# EAGLE design QwiicHUD (EAGLE 9.1.0)
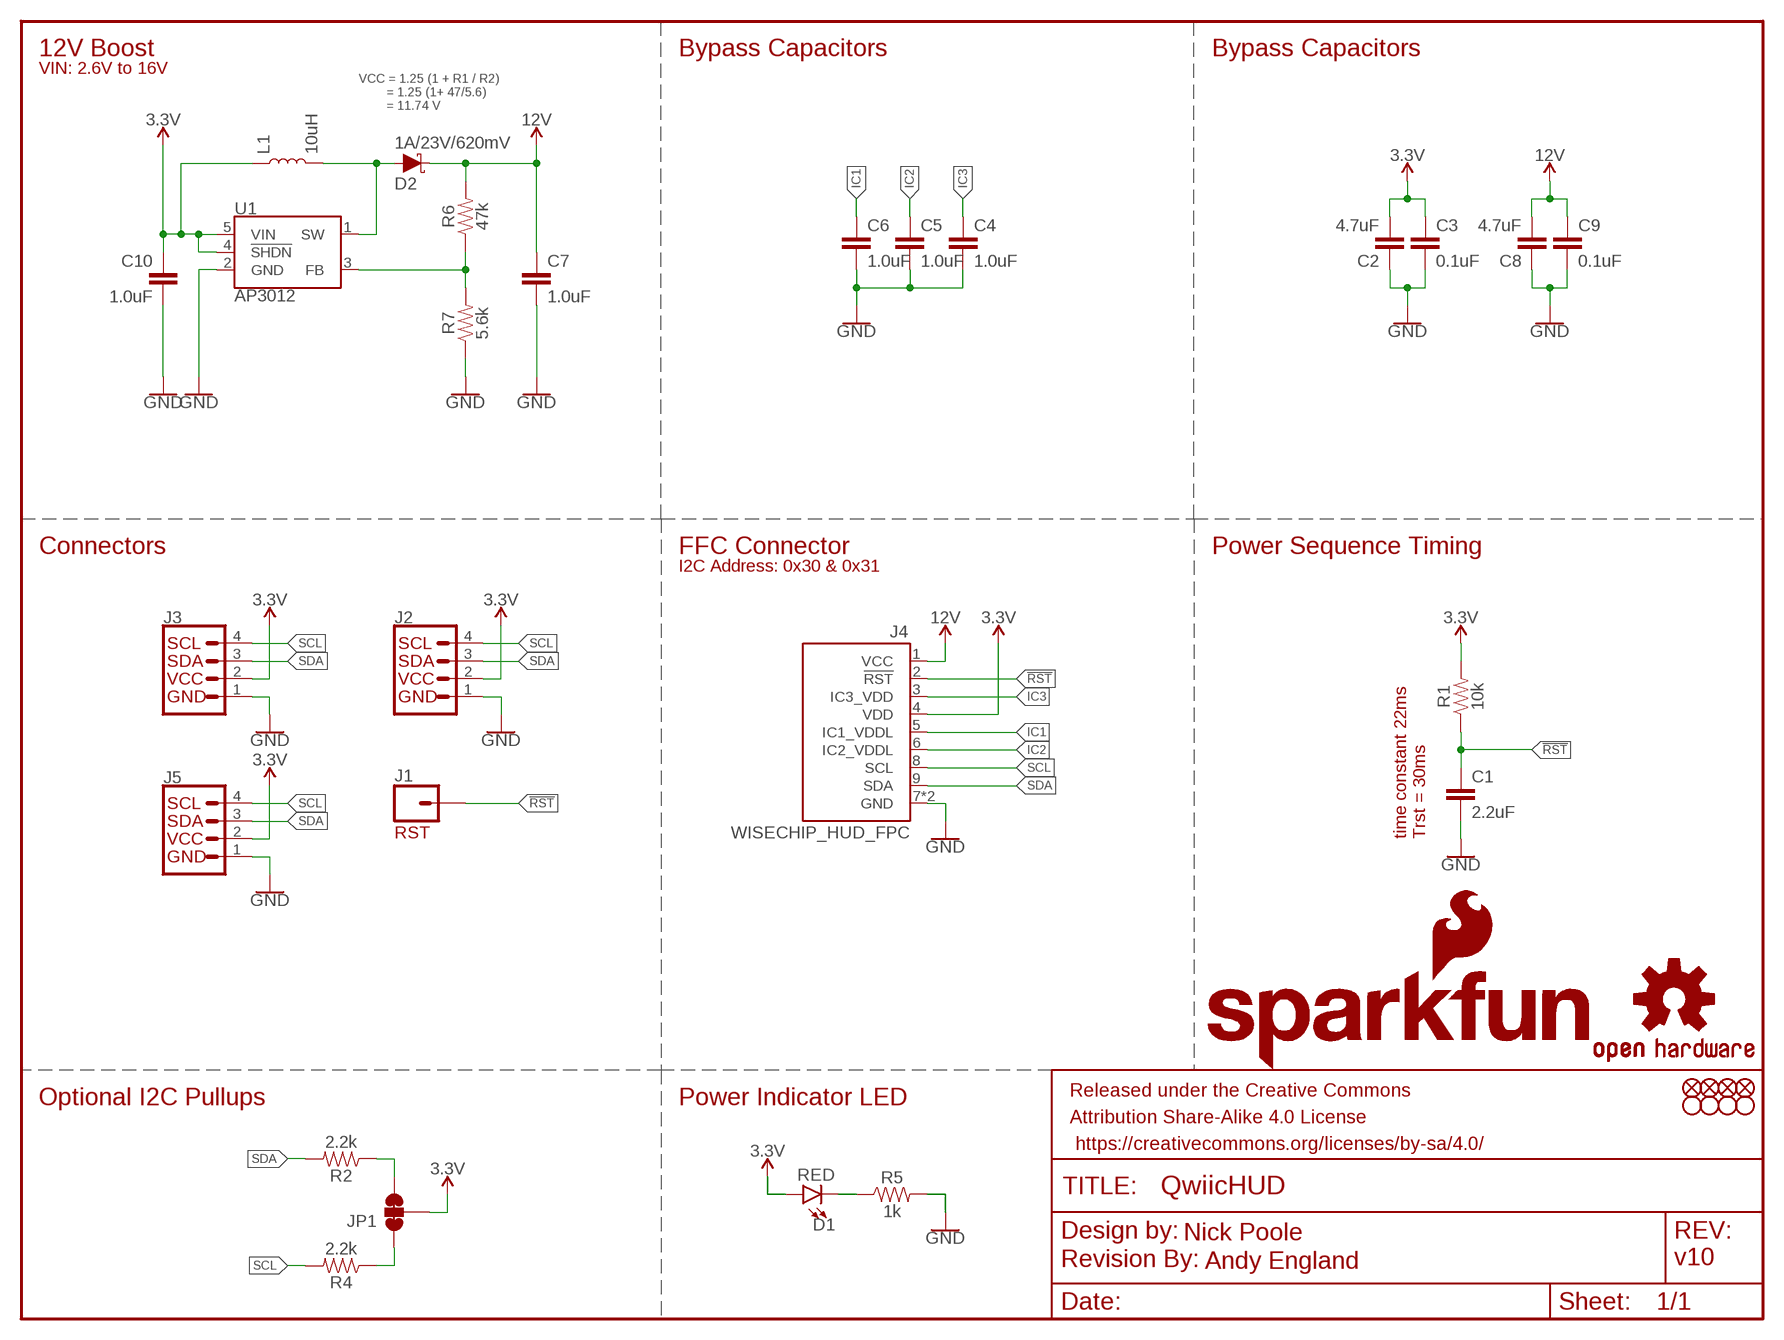
[diagram p0: schematic, sheet 1]

## Parts
C1  2.2uF  2.2UF-0603-10V-20%  [0603]
C2  4.7uF  4.7UF-0603-6.3V-(10%)  [0603]
C3  0.1uF  0.1UF-0603-25V-5%  [0603]
C4  1.0uF  1.0UF-0603-16V-10%  [0603]
C5  1.0uF  1.0UF-0603-16V-10%  [0603]
C6  1.0uF  1.0UF-0603-16V-10%  [0603]
C7  1.0uF  1.0UF-0805-25V-10%  [0805]
C8  4.7uF  4.7UF-0603-6.3V-(10%)  [0603]
C9  0.1uF  0.1UF-0603-25V-5%  [0603]
C10  1.0uF  1.0UF-0603-16V-10%  [0603]
D1  RED  LED-RED0603  [LED-0603]
D2  1A/23V/620mV  DIODE-SCHOTTKY-BAT20J  [SOD-323]
FD1  FIDUCIALUFIDUCIAL  [FIDUCIAL-MICRO]
FD2  FIDUCIALUFIDUCIAL  [FIDUCIAL-MICRO]
FD3  FIDUCIALUFIDUCIAL  [FIDUCIAL-MICRO]
FD4  FIDUCIALUFIDUCIAL  [FIDUCIAL-MICRO]
FRAME1  FRAME-LETTER  [CREATIVE_COMMONS]
H1  STAND-OFF  [STAND-OFF]
H2  STAND-OFF  [STAND-OFF]
H3  STAND-OFF  [STAND-OFF]
H4  STAND-OFF  [STAND-OFF]
J1  CONN_01PTH_NO_SILK_YES_STOP  [1X01_NO_SILK]
J2  I2C_STANDARD_NO_SILK  [1X04_NO_SILK]
J3  QWIIC_CONNECTORJS-1MM  [1X04_1MM_RA]
J4  WISECHIP_HUD_FPC  [SERIES6288]
J5  QWIIC_CONNECTORJS-1MM  [1X04_1MM_RA]
JP1  JUMPER-SMT_3_2-NC_TRACE_SILK  [SMT-JUMPER_3_2-NC_TRACE_SILK]
L1  10uH  INDUCTOR-CDRH-10UH  [INDUCTOR_4.7UH]
LOGO1  OSHW-LOGOS  [OSHW-LOGO-S]
LOGO2  SFE_LOGO_NAME_FLAME.1_INCH  [SFE_LOGO_NAME_FLAME_.1]
LOGO3  SFE_LOGO_FLAME.1_INCH  [SFE_LOGO_FLAME_.1]
LOGO4  REVISION  [REVISION]
R1  10k  10KOHM-0603-1/10W-1%  [0603]
R2  2.2k  2.2KOHM-0603-1/10W-1%  [0603]
R4  2.2k  2.2KOHM-0603-1/10W-1%  [0603]
R5  1k  1KOHM-0603-1/10W-1%  [0603]
R6  47k  47KOHM-0603-1/10W-1%  [0603]
R7  5.6k  5.6KOHM-0603-1/10W-1%  [0603]
U1  AP3012  [SOT23-5]

## Nets
3.3V: C2.2 C3.1 C10.1 D1.A J2.2(VCC) J3.2 J4.4(VDD) J5.2 JP1.2 L1.P$1 R1.2 U1.4(!SHDN!) U1.5(VIN)
12V: C7.1 C8.2 C9.1 D2.C J4.1(VCC) R6.2
!RST: C1.1 J1.1 J4.2(!RST) R1.1
GND: C1.2 C2.1 C3.2 C4.2 C5.2 C6.2 C7.2 C8.1 C9.2 C10.2 J2.1(GND) J3.1 J4.7(GND) J4.10(GND) J5.1 R5.2 R7.1 U1.2(GND)
IC1: C6.1 J4.5(IC1_VDDL)
IC2: C5.1 J4.6(IC2_VDDL)
IC3: C4.1 J4.3(IC3_VDD)
N$1: JP1.3 R2.1
N$2: JP1.1 R4.1
N$3: D1.C R5.1
N$4: D2.A L1.P$2 U1.1(SW)
N$5: R6.1 R7.2 U1.3(FB)
SCL: J2.4(SCL) J3.4 J4.8(SCL) J5.4 R4.2
SDA: J2.3(SDA) J3.3 J4.9(SDA) J5.3 R2.2

## Notes on the sheet
- 12V Boost | Bypass Capacitors | Bypass Capacitors
- VIN: 2.6V to 16V
- VCC = 1.25 (1 + R1 / R2)
          = 1.25 (1+ 47/5.6)
          = 11.74 V
- Connectors | FFC Connector | Power Sequence Timing
- I2C Address: 0x30 & 0x31
- RST
- time constant 22ms
  Trst = 30ms
- Optional I2C Pullups | Power Indicator LED
- Nick Poole
- Andy England | v10

## Library data of the parts
C1 = SparkFun-Capacitors:2.2UF: 2.2µF ceramic capacitors A capacitor is a passive two-terminal electrical component used to store electrical energy temporarily in an electric field.; PROD_ID: CAP-07888
C2 C8 = SparkFun-Capacitors:4.7UF: 4.7µF ceramic capacitors A capacitor is a passive two-terminal electrical component used to store electrical energy temporarily in an electric field.; PROD_ID: CAP-08280
C3 C9 = SparkFun-Capacitors:0.1UF: 0.1µF ceramic capacitors A capacitor is a passive two-terminal electrical component used to store electrical energy temporarily in an electric field.; PROD_ID: CAP-08604
C4-C6 C10 = SparkFun-Capacitors:1.0UF: 1µF ceramic capacitors A capacitor is a passive two-terminal electrical component used to store electrical energy temporarily in an electric field.; PROD_ID: CAP-00868
C7 = SparkFun-Capacitors:1.0UF: 1µF ceramic capacitors A capacitor is a passive two-terminal electrical component used to store electrical energy temporarily in an electric field.; PROD_ID: CAP-08064
D1 = SparkFun-LED:LED-RED: Red SMD LED Used in manufacturing of most products at SparkFun Packages: 0603 - SMD 0603 package [Product Link] <http://docs.avagotech.com/docs/AV02-0551EN> 0603 SMART - SMD 0603 SMART package ( more efficient and expensive)[Product Link] <http://www.osram-os.com/Graphics/XPic2/00077099_0.pdf> 1206 - SMD1206 package [Product Link] <https://www.sparkfun.com/datasheets/DevTools/LilyPad/Q150OVS4.pdff> SparkFun Products: Pro Mini 328 -5V <https://www.sparkfun.com/products/821> RedBoard <https://www.sparkfun.com/products/12757> IOIO-OTG <https://www.sparkfun.com/products/13613>; PROD_ID: DIO-00819
D2 = SparkFun-DiscreteSemi:DIODE-SCHOTTKY: Schottky diode A Schottky diode is a semiconductor diode which has a low forward voltage drop and a very fast switching action.; PROD_ID: DIO-11623
FD1-FD4 = SparkFun-Aesthetics:FIDUCIAL: Fiducial Alignment Points Point-of-reference for pick-and-place machines and other optical instruments.
FRAME1 = SparkFun-Aesthetics:FRAME-LETTER: Schematic Frame - Letter Standard 8.5x11 US Letter frame
H1-H4 = SparkFun-Hardware:STAND-OFF: Stand Off Drill holes for mechanically mounting via screws, standoffs, etc. Note: Use the keepout ring to avoid running the screw head into surrounding components. Variant Overviews STAND-OFF - Mechanical footprint for a #4 phillips button head screw. STAND-OFF-TIGHT - Mechanical footprint for a #4 phillips button head screw, Example SparkFun Products Screw - Phillips Head (1/4", 4-40, 10 pack) <https://www.sparkfun.com/products/10453> (PRT-10453) Screw - Phillips Head (1/2", 4-40, 10 pack) <https://www.sparkfun.com/products/10452> (PRT-10452) Screw - Phillips Head (3/4", 4-40, 10 pack) <https://www.sparkfun.com/products/10451> (PRT-10451) Screw - Phillips Head (1", 4-40, 10 pack) <https://www.sparkfun.com/products/10450> (PRT-10450)
J1 = SparkFun-Connectors:CONN_01: Single connection point. Often used as Generic Header-pin footprint for 0.1 inch spaced/style header connections On any of the 0.1 inch spaced packages, you can populate with these: Break Away Headers - Straight <https://www.sparkfun.com/products/116> (PRT-00116) Break Away Male Headers - Right Angle <https://www.sparkfun.com/products/553> (PRT-00553) Female Headers <https://www.sparkfun.com/products/115> (PRT-00115) Break Away Headers - Machine Pin <https://www.sparkfun.com/products/117> (PRT-00117) Break Away Female Headers - Swiss Machine Pin <https://www.sparkfun.com/products/743> (PRT-00743) This device is also useful as a general connection point to wire up your design to another part of your project. Our various solder wires solder well into these plated through hole pads. Hook-Up Wire - Assortment (Stranded, 22 AWG) <https://www.sparkfun.com/products/11375> (PRT-11375) Hook-Up Wire - Assortment (Solid Core, 22 AWG) <https://www.sparkfun.com/products/11367> (PRT-11367) View the entire wire category on our website here <https://www.sparkfun.com/categories/141> Special notes: SMTSO-256-ET is a "flush mount" nut for a 4-40 screw. We mostly use this on specialty testbeds; it is a nice way to connect hardware to your PCB at an adjustable hieght. Also note, the SNAP packages are for using a snappable style connector. We sell a baggie of snaps and they are also used on two LilyPad designs: Snap Assortment - 30 pack (male and female) <https://www.sparkfun.com/products/11347> (DEV-11347) LilyPad Arduino SimpleSnap <https://www.sparkfun.com/products/10941> (DEV-10941) LilyPad SimpleSnap Protoboard <https://www.sparkfun.com/products/10940> (DEV-10940)
J2 = SparkX:I2C_STANDARD: SparkFun I2C Standard Pinout Header SparkFun has standardized on a pinout for all I2C based sensor breakouts. This pinout allows I2C boards to be plugged directly into the headers on Arduino Uno compatible boards, and to be daisy chained easily. Example SparkFun Products: SparkFun Atmospheric Sensor Breakout - BME280 <https://www.sparkfun.com/products/13676> SparkFun Altitude/Pressure Sensor Breakout - MPL3115A2 <https://www.sparkfun.com/products/11084> SparkFun TOF Range Finder Sensor - VL6180 <https://www.sparkfun.com/products/12785>
J3 J5 = SparkFun-Connectors:QWIIC_CONNECTOR: SparkFun I2C Standard Qwiic Connector An SMD 1mm pitch JST connector makes it easy and quick (get it? Qwiic?) to connect I2C devices to each other. The Qwiic system <http://www.sparkfun.com/qwiic> enables fast and solderless connection between popular platforms and various sensors and actuators. We carry 200mm <https://www.sparkfun.com/products/14204>, 100mm <https://www.sparkfun.com/products/14205>, 50mm <https://www.sparkfun.com/products/14206>, and breadboard friendly <https://www.sparkfun.com/products/14207> Qwiic cables. We also offer 10 pcs strips <https://www.sparkfun.com/products/14323> the SMD connectors.; PROD_ID: CONN-13694
J4 = SparkFun-Displays:WISECHIP_HUD_FPC: Kyocera 046288010000846+ - 10 Position Flat Flex Cable Connector for WiseChip HUD This 10 position FFC connects to the WiseChip transparent OLED HUD (Part Number: WiseChip US-0011 MIAG01, SFE SKU: LCD-14137) SparkFun Products: SparkX Qwiic Transparent OLED HUD <https://www.sparkfun.com/products/14691>; PROD_ID: LCD-14137, CONN-14136
JP1 = SparkFun-Jumpers:JUMPER-SMT_3_2-NC_TRACE: Normally closed trace jumper (2 of 2 connections) This jumper has a trace between all three pads so they are normally closed (NC). Use a razor knife to open the connection(s). For best results follow the IPC guidelines for cutting traces: Cutout at least 0.063 mm (0.005 in). Remove all loose material to clean up the cut area. Seal the cut with an approved epoxy. Reapply solder to reclose the connection(s).
L1 = SparkFun-Coils:INDUCTOR: Inductors Resist changes in electrical current. Basically a coil of wire. SparkFun Products: SparkFun Load Cell Amplifier - HX711 <https://www.sparkfun.com/products/13879> IOIO-OTG - V2.2 <https://www.sparkfun.com/products/13613>; PROD_ID: NDUC-13968
LOGO1 = SparkFun-Aesthetics:OSHW-LOGO: Open-Source Hardware (OSHW) Logo This logo indicates the piece of hardware it is found on incorporates a OSHW license and/or adheres to the definition of open source hardware found here: http://freedomdefined.org/OSHW
LOGO2 = SparkFun-Aesthetics:SFE_LOGO_NAME_FLAME: SparkFun Font Logo w/ Flame This is the SparkFun full logo. The logo on the schematic will always be the same size; the package variant is the height of the flame part of the logo. Default layer for the logo on the board is tSilk.
LOGO3 = SparkFun-Aesthetics:SFE_LOGO_FLAME: SparkFun Flame Logo This is the SparkFun flame logo. The logo on the schematic will always be the same size; the package variant is the height of the flame. Default layer for the logo on the board is tSilk.
LOGO4 = SparkFun-Aesthetics:REVISION: "Revision By" Text Preceding text for revisor documentation. Includes schematic text on "symbols" layer, and board text on tDoc.
R1 = SparkFun-Resistors:10KOHM: 10kΩ resistor A resistor is a passive two-terminal electrical component that implements electrical resistance as a circuit element. Resistors act to reduce current flow, and, at the same time, act to lower voltage levels within circuits. - Wikipedia; PROD_ID: RES-00824
R2 R4 = SparkFun-Resistors:2.2KOHM: 2.2kΩ resistor A resistor is a passive two-terminal electrical component that implements electrical resistance as a circuit element. Resistors act to reduce current flow, and, at the same time, act to lower voltage levels within circuits. - Wikipedia; PROD_ID: RES-08272
R5 = SparkFun-Resistors:1KOHM: 1kΩ resistor A resistor is a passive two-terminal electrical component that implements electrical resistance as a circuit element. Resistors act to reduce current flow, and, at the same time, act to lower voltage levels within circuits. - Wikipedia; PROD_ID: RES-07856
R6 = SparkFun-Resistors:47KOHM: 47kΩ resistor A resistor is a passive two-terminal electrical component that implements electrical resistance as a circuit element. Resistors act to reduce current flow, and, at the same time, act to lower voltage levels within circuits. - Wikipedia; PROD_ID: RES-07871
R7 = SparkFun-Resistors:5.6KOHM: 5.6kΩ resistor A resistor is a passive two-terminal electrical component that implements electrical resistance as a circuit element. Resistors act to reduce current flow, and, at the same time, act to lower voltage levels within circuits. - Wikipedia; PROD_ID: RES-12378
U1 = SparkFun-IC-Power:AP3012: AP3012 The AP3012 is a high power, constant frequency, current mode PWM, inductor based, step-up (boost) converter. The converter operates at high frequency (1.5MHz) so that a small, low profile inductor can be used. Datasheet <https://www.diodes.com/assets/Datasheets/AP3012.pdf>; PROD_ID: VREG-13911

## Board
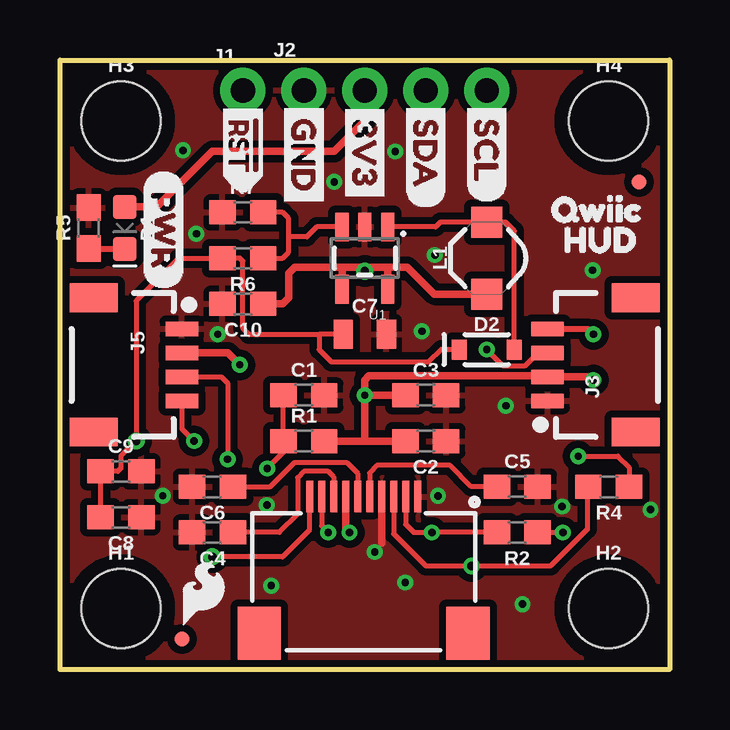
[diagram p1: board, top side]
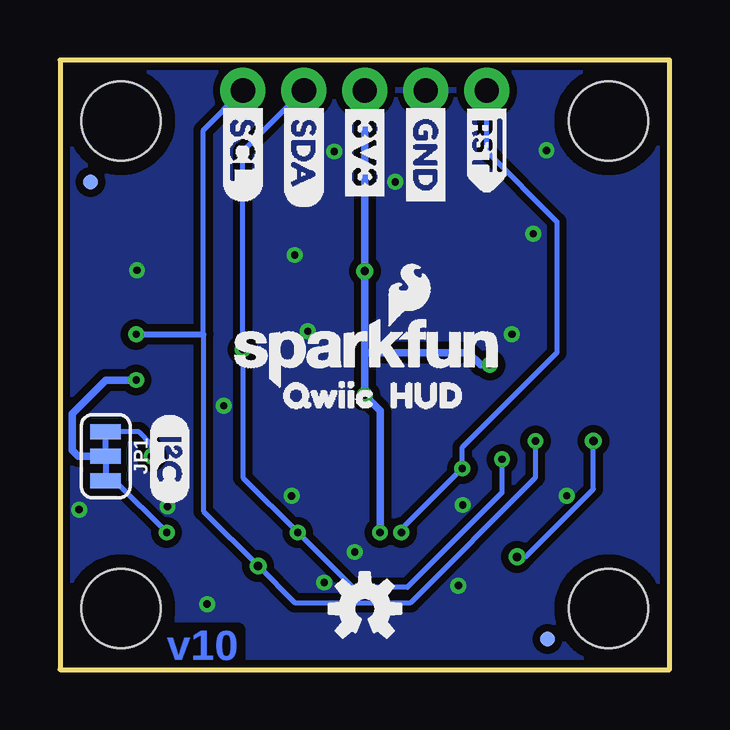
[diagram p2: board, bottom side, seen from below]

Size 25.4 x 25.4 mm. Coordinates in mm from the lower left corner, seen from the top.
Outline: 0,25.4 25.4,25.4 25.4,0 0,0 0,25.4
Copper layers (1*16): Top 0.035mm / dielectric 1.5mm / Bottom 0.035mm
Design rules "SparkFun-2-layer-TIGHT *": minimum track width 6mil, minimum drill 12mil, track to track 6mil, track to pad 6mil, pad to pad 6mil, via to via 6mil, smd to smd 6mil, copper to edge 7mil, drill to drill 7mil, minimum pad ring 7mil, minimum via ring 7mil, stop-mask expansion 4mil, vias tented up to drill 25mil, thermal gap 10mil

### Footprints (pad centres in the part's own frame; a part is rotated, then mirrored left to right if it is on the bottom)
0603 = smd 1.1 x 1: 1 -0.85,0; 2 0.85,0
0805 = smd 0.8 x 1.2: 1 -0.9,0; 2 0.9,0
LED-0603 = smd 1 x 1: A -0.877,0; C 0.877,0
SOD-323 = smd 0.63 x 0.83: A 1.15,0; C -1.15,0
FIDUCIAL-MICRO = smd 0.635 x 0.635: 1 0,0
STAND-OFF = hole 3.302: 0,0
1X01_NO_SILK = drill 1.016 pad 1.88: 1 0,0
1X04_NO_SILK = drill 1.016 pad 1.88: 1 0,0; 2 2.54,0; 3 5.08,0; 4 7.62,0
1X04_1MM_RA = smd 0.6 x 1.35: 1 -1.5,0; 2 -0.5,0; 3 0.5,0; 4 1.5,0 | smd 1.2 x 2: NC1 2.8,-3.675; NC2 -2.8,-3.675
SERIES6288 = smd 0.3 x 1.3: 1 -2.3,3.4; 2 -1.8,3.4; 3 -1.3,3.4; 4 -0.8,3.4; 5 -0.3,3.4; 6 0.2,3.4; 7 0.7,3.4; 8 1.2,3.4; 9 1.7,3.4; 10 2.2,3.4 | smd 1.8 x 2.2: NC1 -4.4,-2.3; NC2 4.3,-2.3
SMT-JUMPER_3_2-NC_TRACE_SILK = smd 0.635 x 1.27: 1 -1.016,0; 2 0,0; 3 1.016,0
INDUCTOR_4.7UH = smd 1.3 x 1.3: P$1 -1.5,0; P$2 1.5,0
SOT23-5 = smd 0.55 x 1.2: 1 -0.95,-1.3; 2 0,-1.3; 3 0.95,-1.3; 4 0.95,1.3; 5 -0.95,1.3

### Placement (x,y rotation side)
C1  10.16,11.43 0 top
C2  15.24,9.53 180 top
C3  15.24,11.43 0 top
C4  6.35,5.71 180 top
C5  19.05,7.62 0 top
C6  6.35,7.62 180 top
C7  12.7,13.97 0 top
C8  2.54,6.35 180 top
C9  2.54,8.26 0 top
C10  7.62,15.24 180 top
D1  2.7,18.4 270 top
D2  17.78,13.34 0 top
FD1  5.08,1.27 0 top
FD2  24.13,20.32 0 top
FD3  5.08,1.27 0 bottom
FD4  24.13,20.32 0 bottom
FRAME1  -17.78,-10.16 0 top  (outside the outline)
H1  2.54,2.54 0 top
H2  22.86,2.54 0 top
H3  2.54,22.86 0 top
H4  22.86,22.86 0 top
J1  7.62,24.13 0 top
J2  10.16,24.13 0 top
J3  20.32,12.7 90 top
J4  12.7,3.81 0 top
J5  5.08,12.7 270 top
JP1  23.5,8.89 270 bottom
L1  17.78,17.14 90 top
LOGO1  12.7,2.54 0 bottom
LOGO2  12.57,13.21 0 bottom
LOGO3  5.97,3.17 0 top
LOGO4  -6.35,-12.7 0 top  (outside the outline)
R1  10.16,9.53 0 top
R2  19.05,5.71 180 top
R4  22.86,7.62 180 top
R5  1.2,18.4 90 top
R6  7.62,17.14 180 top
R7  7.62,19.05 0 top
U1  12.7,17.14 180 top
U$1  [#RST>]  7.62,24 270 top
U$2  [QWIIC0]  19.56,19.18 0 top
U$3  [HUD1]  20.07,17.91 0 top
U$5  [GND]  10.16,23.88 270 top
U$6  [3V3]  12.7,23.88 270 top
U$7  [SDA]  15.24,23.88 270 top
U$8  [SCL]  17.78,23.88 270 top
U$9  [(PWR)]  4.32,20.83 270 top
U$10  [SDA]  15.24,23.88 270 bottom
U$11  [SCL]  17.78,23.88 270 bottom
U$12  [3V3]  12.7,23.88 270 bottom
U$13  [GND]  10.16,23.88 270 bottom
U$14  [#RST>]  7.62,24 270 bottom
U$18  [QWIIC0]  17.02,11.43 0 bottom
U$19  [HUD1]  12.57,11.43 0 bottom
U$20  [(I_SUPER2_C)]  20.83,10.67 270 bottom

### Tracks (layer width: path | path; a pad name or v marks a point on that pad's centre or on a via)
3.3V  (via drill 0.3, 0.35)
  Top 0.203: 11.81,9.53
  Top 0.305: v22.23,12.06 22.09,12.2 J3.2 20.29,12.23 12.87,12.23 12.7,12.06 v12.7,11.43 | J4.4 11.9,5.88 v12.06,5.71 | C3.1 v12.7,11.43 | R1.2 11.81,9.53 12.06,9.53 12.7,9.53 | C2.2 12.7,9.53 | v7.49,12.7 6.99,13.2 J5.2 | D1.A 4.04,19.28 6.35,21.59 11.43,21.59 12.7,22.86 J2.2 | 11.68,16.76 12.7,16.76 | 12.7,16.76 13.59,16.76 | 13.59,16.76 14.48,16.76 15.6,15.64 L1.P$1 | U1.5 13.65,16.7 13.59,16.76 | U1.4 11.75,16.7 11.68,16.76 | v12.7,16.61 12.7,16.76 | C10.1 9.27,15.24 9.53,15.49 9.53,16.51 9.78,16.76 11.68,16.76 | v12.7,11.43 12.7,9.53
  Bottom 0.305: v22.23,12.06 23.5,12.06 24.89,10.67 24.89,9.14 24.64,8.89 JP1.2 | v12.06,5.71 12.06,10.79 v12.7,11.43 12.7,13.21 | v7.49,12.7 7.87,12.7 8.38,13.21 12.7,13.21 | 12.7,13.21 v12.7,16.61 J2.2
12V  (via drill 0.35)
  Top 0.203: J4.1 10.4,5.83 9.27,4.7 v6.35,4.7 | C8.2 C9.1 2.41,8.26 2.54,8.38 2.54,8.89 v3.17,9.53 3.17,15.37 4.95,17.14 R6.2 7.49,17.14 7.62,17.02 7.62,14.22 7.87,13.97 10.29,13.97 10.79,13.97 | D2.C 15.88,13.34 15.37,12.83 11.3,12.83 10.79,13.34 10.79,13.97 | C7.1 10.79,13.97
  Bottom 0.203: v3.17,9.53 3.17,7.52 6,4.7 v6.35,4.7
!RST  (via drill 0.3)
  Top 0.203: C1.1 R1.1 9.31,9.06 v8.64,8.38 | J4.2 10.9,5.99 v11.18,5.71
  Bottom 0.203: J1.1 7.62,21.59 4.7,18.67 4.7,13.21 8.64,9.27 v8.64,8.38 11.18,5.84 v11.18,5.71
GND  (via drill 0.3)
  Top 0.305: J4.7 13.4,5.27
  other vias: 15.75,7.24 5.13,21.64 5.68,18.16 8.62,6.86 8.8,3.5 19.27,2.73 15.08,14.1 22.19,16.64 24.6,6.67 6.57,13.97 4.28,7.24 20.92,6.79 13.97,21.59 11.43,20.32 13.12,4.9 14.39,3.63 18.58,10.99 15.62,17.27
  pour Bottom (isolate 0.305): 0,25.4 25.4,25.4 25.4,0 0,0
  pour Top (isolate 0.305): 0,25.4 25.4,25.4 25.4,0 0,0
IC1
  Top 0.203: C6.1 8.76,7.62 9.78,8.64 11.94,8.64 12.4,8.17 J4.5
IC2
  Top 0.203: C5.1 17.14,7.62 16.26,8.51 13.21,8.51 12.9,8.2 J4.6
IC3
  Top 0.203: J4.3 11.4,8.03 11.18,8.26 10.16,8.26 9.91,8 9.91,6.48 9.14,5.71 C4.1
N$1  (via drill 0.3)
  Top 0.203: R2.1 v20.95,5.71
  Bottom 0.203: v20.95,5.71 23.11,7.87 JP1.3
N$2  (via drill 0.3)
  Top 0.203: R4.1 23.71,8.42 23.24,8.89 v21.59,8.89
  Bottom 0.203: v21.59,8.89 21.59,9.4 22.1,9.91 JP1.1
N$3
  Top 0.254: D1.C 1.23,17.52 R5.1
N$4
  Top 0.203: L1.P$2 17.93,18.64 L1.P$2 | L1.P$2 15.85,18.64 15.65,18.45 U1.1 | L1.P$2 18.57,18.64 18.93,18.28 D2.A
N$5
  Top 0.203: R6.1 9.27,17.14 9.53,17.4 9.53,18.03 | R7.2 9.27,19.05 9.53,18.8 9.53,18.03 | U1.3 10.7,18.45 10.29,18.03 9.53,18.03
SCL  (via drill 0.3, 0.35)
  Top 0.203: J5.4 5.08,10.03 v5.59,9.53 | J4.8 13.9,5.66 15.24,4.32 v17.14,4.32 20.45,4.32 21.97,5.84 21.97,7.58 R4.2
  Top 0.254: J3.4 22,14.2 v22.23,13.97
  Bottom 0.203: J2.4 19.43,22.48 19.43,13.97 19.43,6.6 v17.14,4.32 15.62,2.79 10.79,2.79 5.59,8 v5.59,9.53
  Bottom 0.254: v22.23,13.97 19.43,13.97
SDA  (via drill 0.3)
  Top 0.203: J5.3 6.72,12.2 6.99,11.94 v6.99,8.76 | J4.9 14.4,6.05 14.73,5.71 v15.49,5.71 R2.2 | v17.78,13.34 18.45,12.66 19.39,12.66 19.93,13.2 J3.3
  Bottom 0.203: J2.3 17.78,21.59 17.78,13.72 v17.78,13.34 17.78,8 v15.49,5.71 13.21,3.43 10.92,3.43 6.99,7.37 v6.99,8.76

### Text on the board
Bottom: v10
tDocu: Nick Poole | Andy England